# EAGLE design TestAnalog (EAGLE 5.11)
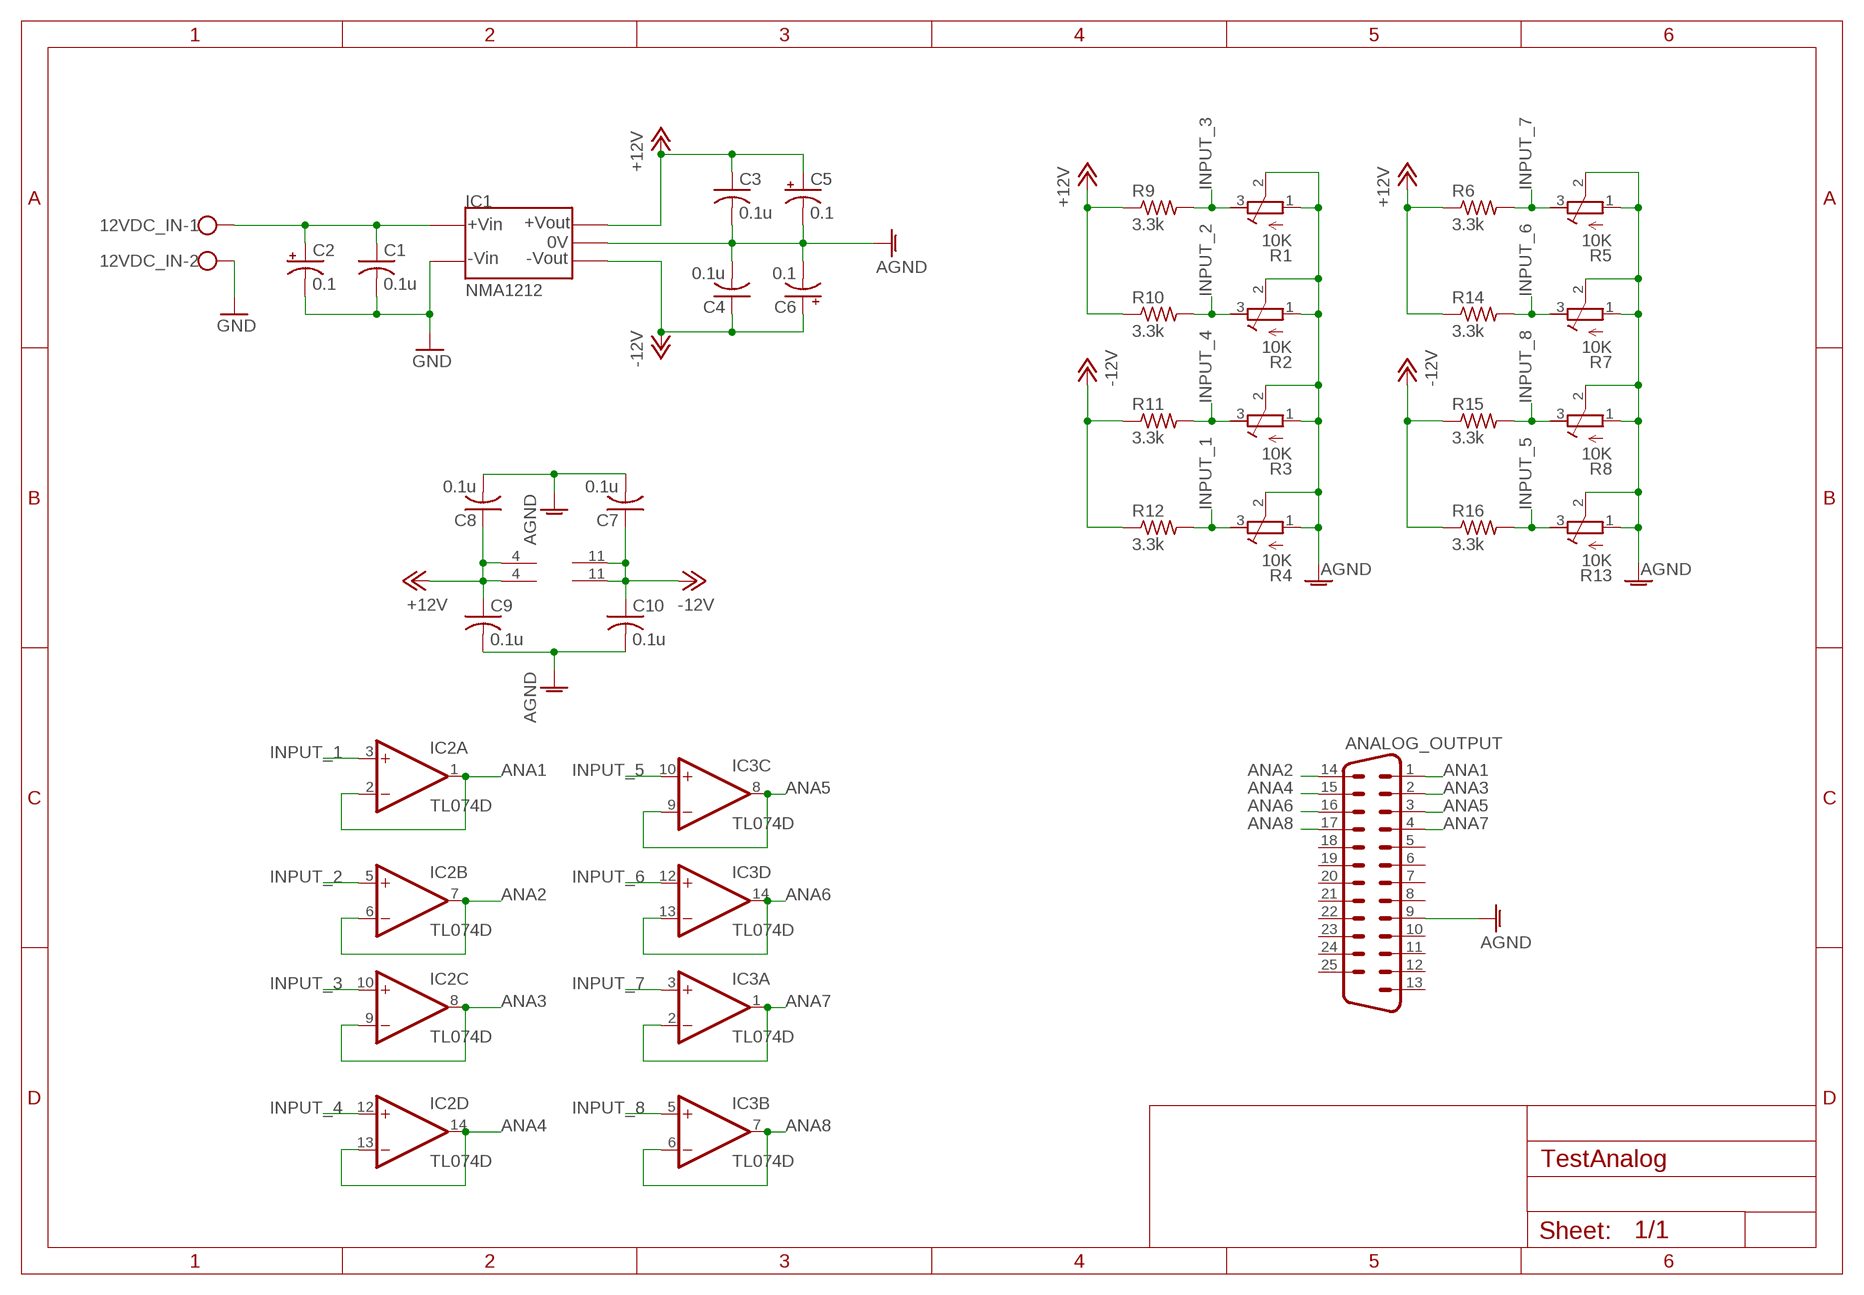
[diagram p0: schematic, sheet 1]

## Parts
12VDC_IN  W237-102  [W237-102]
ANALOG_OUTPUT  M25HP  [M25HP]
C1  0.1u  C-USC0603  [C0603]
C2  0.1  CPOL-USB45181A  [B45181A]
C3  0.1u  C-USC0603  [C0603]
C4  0.1u  C-USC0603  [C0603]
C5  0.1  CPOL-USB45181A  [B45181A]
C6  0.1  CPOL-USB45181A  [B45181A]
C7  0.1u  C-USC0603  [C0603]
C8  0.1u  C-USC0603  [C0603]
C9  0.1u  C-USC0603  [C0603]
C10  0.1u  C-USC0603  [C0603]
IC1  NMA1212  NMA1512DC  [NMA1512DC]
IC2  TL074D  [SO14]
IC3  TL074D  [SO14]
R1  10K  R-TRIMM64W  [RTRIM64W]
R2  10K  R-TRIMM64W  [RTRIM64W]
R3  10K  R-TRIMM64W  [RTRIM64W]
R4  10K  R-TRIMM64W  [RTRIM64W]
R5  10K  R-TRIMM64W  [RTRIM64W]
R6  3.3k  R-US_R0805  [R0805]
R7  10K  R-TRIMM64W  [RTRIM64W]
R8  10K  R-TRIMM64W  [RTRIM64W]
R9  3.3k  R-US_R0805  [R0805]
R10  3.3k  R-US_R0805  [R0805]
R11  3.3k  R-US_R0805  [R0805]
R12  3.3k  R-US_R0805  [R0805]
R13  10K  R-TRIMM64W  [RTRIM64W]
R14  3.3k  R-US_R0805  [R0805]
R15  3.3k  R-US_R0805  [R0805]
R16  3.3k  R-US_R0805  [R0805]

## Nets
+12V: C3.1 C5.+ C8.1 C9.1 IC1.+VOUT IC2.4(P:V+) IC3.4(P:V+) R6.1 R9.1 R10.1 R14.1
-12V: C4.1 C6.+ C7.1 C10.1 IC1.-VOUT IC2.11(P:V-) IC3.11(P:V-) R11.1 R12.1 R15.1 R16.1
AGND: ANALOG_OUTPUT.9 C3.2 C4.2 C5.- C6.- C7.2 C8.2 C9.2 C10.2 IC1.0V R1.1(E) R1.2(S) R2.1(E) R2.2(S) R3.1(E) R3.2(S) R4.1(E) R4.2(S) R5.1(E) R5.2(S) R7.1(E) R7.2(S) R8.1(E) R8.2(S) R13.1(E) R13.2(S)
ANA1: ANALOG_OUTPUT.1 IC2.1(A:OUT) IC2.2(A:-IN)
ANA2: ANALOG_OUTPUT.14 IC2.6(B:-IN) IC2.7(B:OUT)
ANA3: ANALOG_OUTPUT.2 IC2.8(C:OUT) IC2.9(C:-IN)
ANA4: ANALOG_OUTPUT.15 IC2.13(D:-IN) IC2.14(D:OUT)
ANA5: ANALOG_OUTPUT.3 IC3.8(C:OUT) IC3.9(C:-IN)
ANA6: ANALOG_OUTPUT.16 IC3.13(D:-IN) IC3.14(D:OUT)
ANA7: ANALOG_OUTPUT.4 IC3.1(A:OUT) IC3.2(A:-IN)
ANA8: ANALOG_OUTPUT.17 IC3.6(B:-IN) IC3.7(B:OUT)
GND: 12VDC_IN.2 C1.2 C2.- IC1.-VIN
INPUT_1: IC2.3(A:+IN) R4.3(A) R12.2
INPUT_2: IC2.5(B:+IN) R2.3(A) R10.2
INPUT_3: IC2.10(C:+IN) R1.3(A) R9.2
INPUT_4: IC2.12(D:+IN) R3.3(A) R11.2
INPUT_5: IC3.10(C:+IN) R13.3(A) R16.2
INPUT_6: IC3.12(D:+IN) R7.3(A) R14.2
INPUT_7: IC3.3(A:+IN) R5.3(A) R6.2
INPUT_8: IC3.5(B:+IN) R8.3(A) R15.2
N$1: 12VDC_IN.1 C1.1 C2.+ IC1.+VIN
Unconnected: ANALOG_OUTPUT.5 ANALOG_OUTPUT.6 ANALOG_OUTPUT.7 ANALOG_OUTPUT.8 ANALOG_OUTPUT.10 ANALOG_OUTPUT.11 ANALOG_OUTPUT.12 ANALOG_OUTPUT.13 ANALOG_OUTPUT.18 ANALOG_OUTPUT.19 ANALOG_OUTPUT.20 ANALOG_OUTPUT.21 ANALOG_OUTPUT.22 ANALOG_OUTPUT.23 ANALOG_OUTPUT.24 ANALOG_OUTPUT.25

## Library data of the parts
12VDC_IN = con-wago-500:W237-102: WAGO SCREW CLAMP; MPN: 237-102; OC_FARNELL: unknown; OC_NEWARK: 70K9898
ANALOG_OUTPUT = con-subd:M25: SUB-D; OC_FARNELL: unknown; OC_NEWARK: unknown
C1 C3 C4 C7-C10 = rcl:C-US: CAPACITOR, American symbol
C2 C5 C6 = rcl:CPOL-US: POLARIZED CAPACITOR, American symbol
IC1 = magnetometro:NMA1512DC
IC2 IC3 = linear:TL074: OP AMP
R1-R5 R7 R8 R13 = rcl:R-TRIMM: Trimm resistor
R6 R9-R12 R14-R16 = rcl:R-US_: RESISTOR, American symbol

## Board
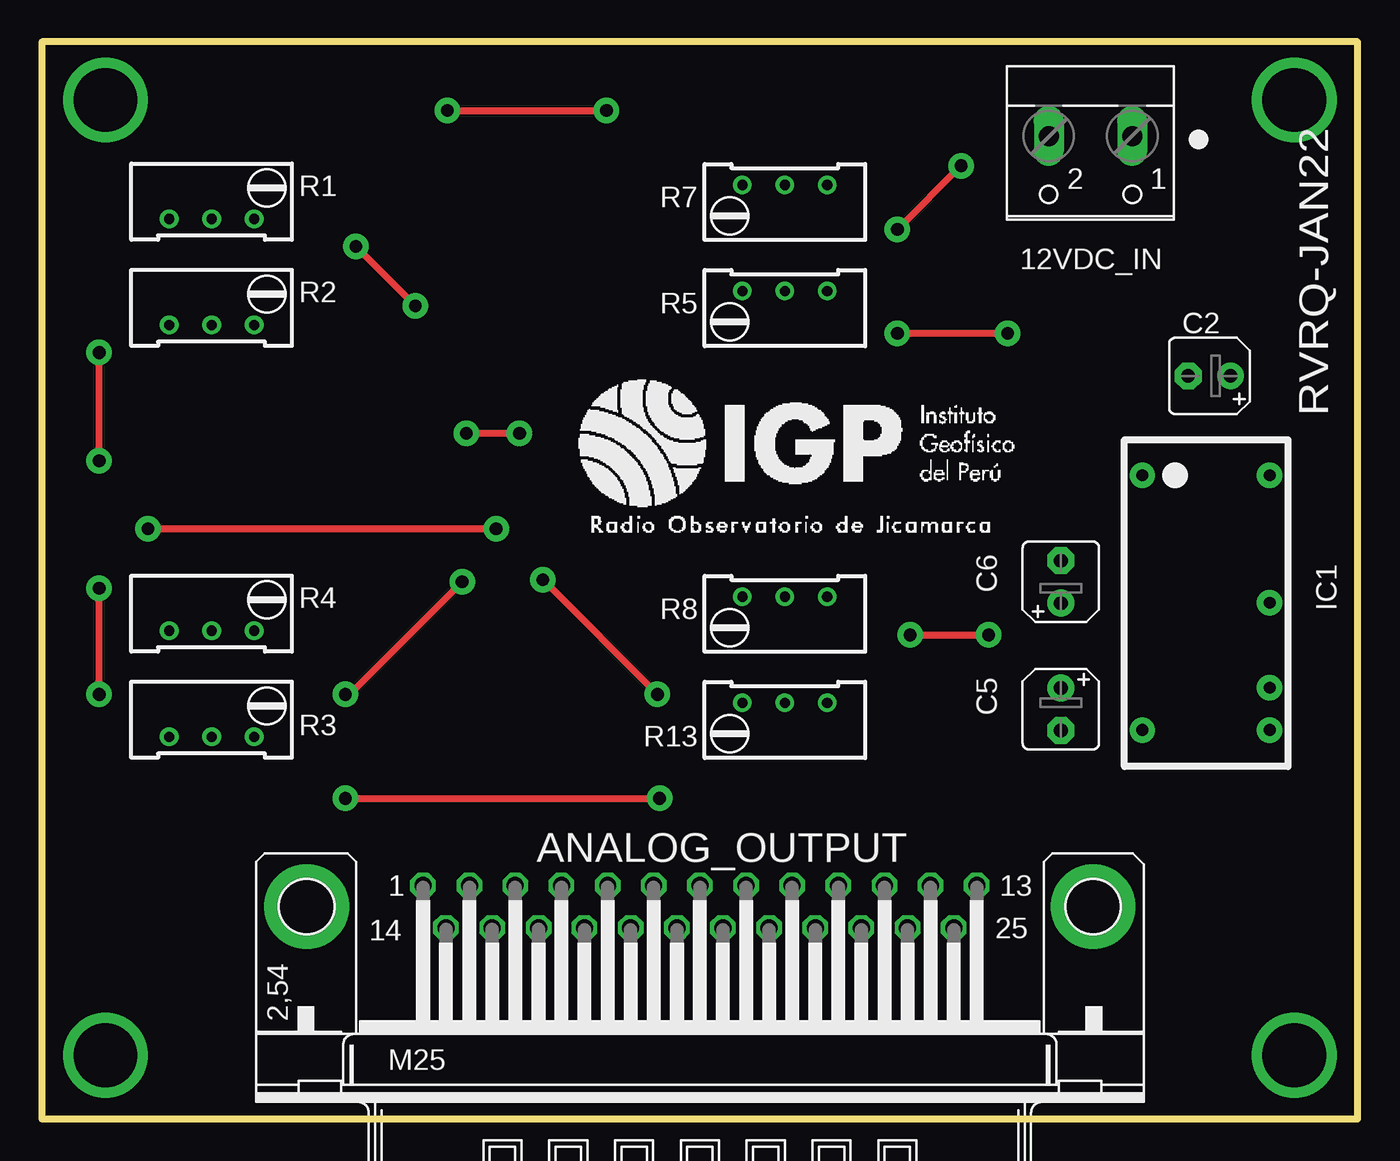
[diagram p1: board, top side]
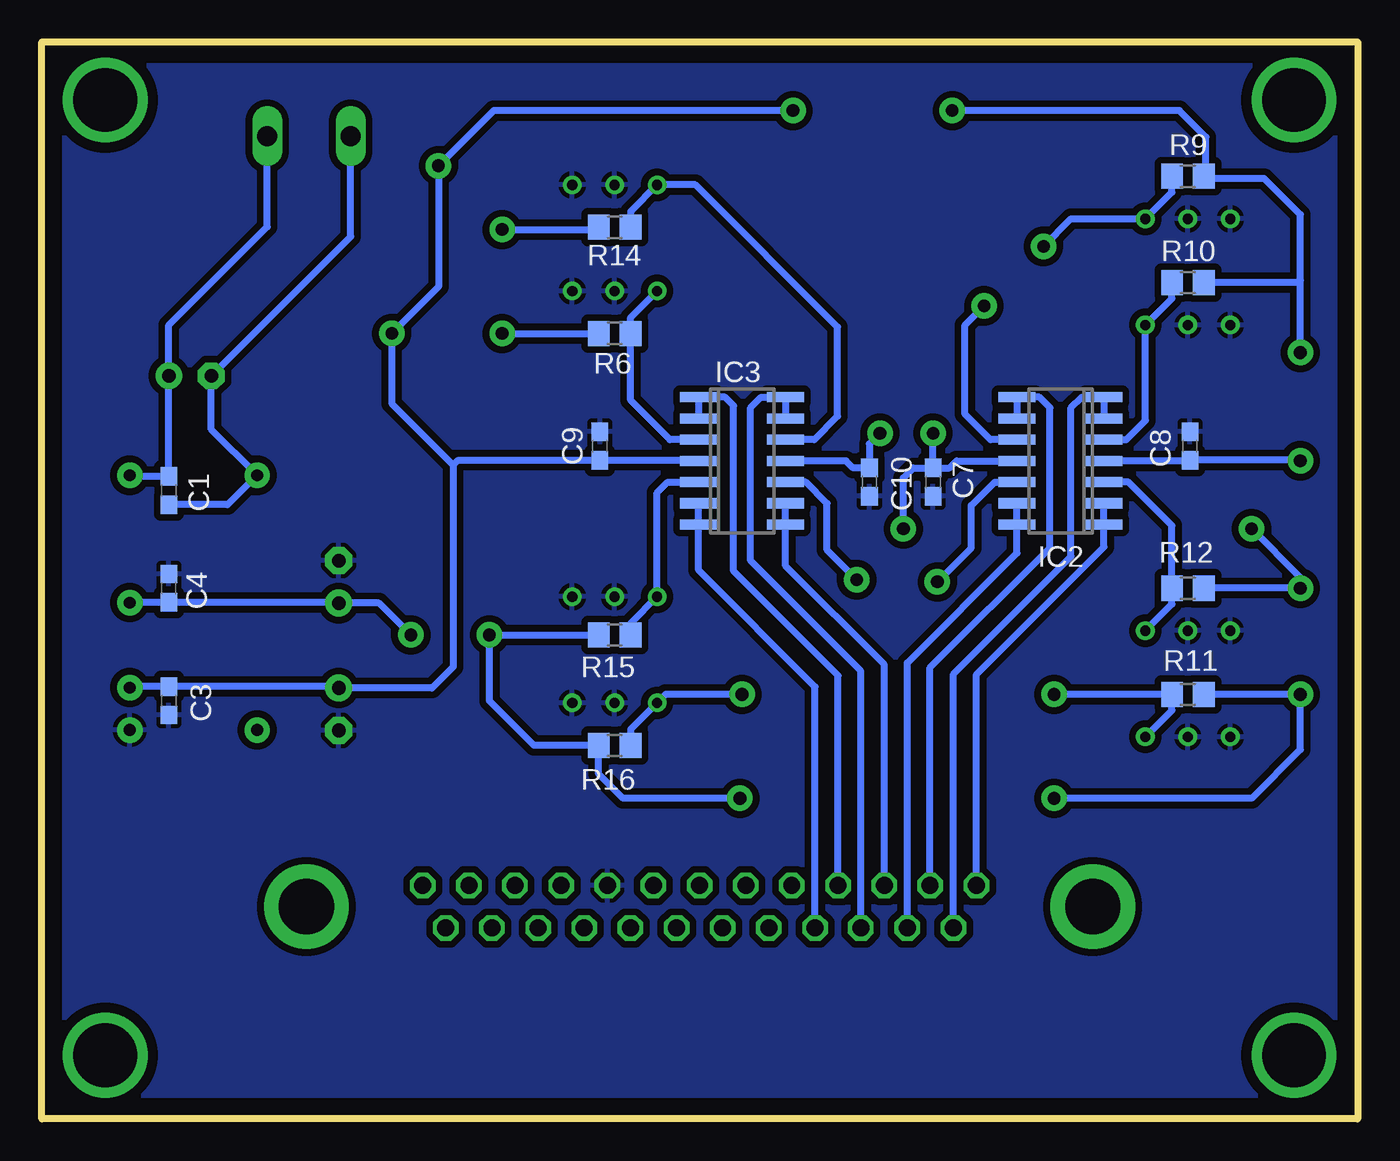
[diagram p2: board, bottom side, seen from below]

Size 78.72 x 64.44 mm. Coordinates in mm from the lower left corner, seen from the top.
Outline: 0,0 78.72,0 78.72,64.44 0,64.44 0,0
Copper layers (1*16): Top 0.035mm / dielectric 1.5mm / Bottom 0.035mm
Design rules "default": minimum track width 10mil, minimum drill 24mil, track to track 8mil, track to pad 8mil, pad to pad 8mil, via to via 8mil, smd to smd 8mil, copper to edge 40mil, drill to drill 8mil, minimum pad ring 10mil, minimum via ring 8mil, stop-mask expansion 4mil, vias tented up to drill 0mil, thermal gap 10mil
bRestrict: area 1.3,58.4 to 6.3,63.5; area 1.3,1.3 to 6.3,6.3; area 72.4,58.4 to 77.5,63.5; area 72.4,1.3 to 77.5,6.3

### Footprints (pad centres in the part's own frame; a part is rotated, then mirrored left to right if it is on the bottom)
W237-102 = drill 1.194 long: 1 -2.5,-0.381; 2 2.5,-0.381
M25HP = drill 1.016 octagon: 1 -16.561,1.27; 2 -13.792,1.27; 3 -11.049,1.27; 4 -8.28,1.27; 5 -5.512,1.27; 6 -2.769,1.27; 7 0,1.27; 8 2.769,1.27; 9 5.512,1.27; 10 8.28,1.27; 11 11.049,1.27; 12 13.792,1.27; 13 16.561,1.27; 14 -15.189,-1.27; 15 -12.421,-1.27; 16 -9.652,-1.27; 17 -6.909,-1.27; 18 -4.14,-1.27; 19 -1.372,-1.27; 20 1.372,-1.27; 21 4.14,-1.27; 22 6.909,-1.27; 23 9.652,-1.27; 24 12.421,-1.27; 25 15.189,-1.27 | drill 3.302 pad 5.08 round: G1 -23.52,0; G2 23.52,0
C0603 = smd 1.1 x 1: 1 -0.85,0; 2 0.85,0
B45181A = drill 0.813 pad 1.6 round: + -1.27,0 | drill 0.813 pad 1.6 octagon: - 1.27,0
NMA1512DC = drill 0.7 pad 1.524 round: 0V 17.374,8.687; +VIN 2.134,8.687; +VOUT 14.834,8.687; -VIN 2.134,1.067; -VOUT 9.754,8.687; NC 17.374,1.067
SO14 = smd 0.6 x 2.2: 1 -3.81,-2.6; 2 -2.54,-2.6; 3 -1.27,-2.6; 4 0,-2.6; 5 1.27,-2.6; 6 2.54,-2.6; 7 3.81,-2.6; 8 3.81,2.6; 9 2.54,2.6; 10 1.27,2.6; 11 0,2.6; 12 -1.27,2.6; 13 -2.54,2.6; 14 -3.81,2.6
RTRIM64W = drill 0.61 round: 1 1.27,-2.54; 2 1.27,0; 3 1.27,2.54
R0805 = smd 1.3 x 1.5: 1 -0.95,0; 2 0.95,0

### Placement (x,y rotation side)
12VDC_IN  62.74,58.42 180 top
ANALOG_OUTPUT  39.37,12.7 0 top
C1  71.12,37.59 270 bottom
C2  69.85,44.45 180 top
C3  71.12,25.02 270 bottom
C4  71.12,31.75 90 bottom
C5  60.96,24.51 270 top
C6  60.96,32.13 90 top
C7  25.4,38.1 270 bottom
C8  10.03,40.26 90 bottom
C9  45.34,40.26 90 bottom
C10  29.21,38.1 270 bottom
IC1  64.77,40.64 270 top
IC2  17.78,39.37 90 bottom
IC3  36.83,39.37 270 bottom
R1  10.16,55.12 270 top
R2  10.16,48.77 270 top
R3  10.16,24.13 270 top
R4  10.16,30.48 270 top
R5  44.45,48.26 90 top
R6  44.45,46.99 0 bottom
R7  44.45,54.61 90 top
R8  44.45,29.97 90 top
R9  10.16,56.39 180 bottom
R10  10.16,50.04 180 bottom
R11  10.16,25.4 180 bottom
R12  10.16,31.75 180 bottom
R13  44.45,23.62 90 top
R14  44.45,53.34 0 bottom
R15  44.45,28.96 0 bottom
R16  44.45,22.35 0 bottom

### Tracks (layer width: path | path; a pad name or v marks a point on that pad's centre or on a via)
+12V  (via drill 0.76 pad 1.52)
  Top 0.406: v3.43,39.37 v3.43,45.85 | v54.99,57.02 v51.18,53.21 | v57.78,46.99 v51.18,46.99 | v24.26,60.33 v33.78,60.33
  Bottom 0.406: IC2.4 10.07,39.37 C8.1 3.47,39.41 v3.43,39.37 | IC3.4 39.47,39.41 C9.1 | 9.08,56.26 9.08,58.74 10.67,60.33 v24.26,60.33 | IC1.+VOUT 73.39,25.87 C3.1 61.05,25.87 C5.+ 55.37,25.78 54.1,27.05 54.1,39.12 | 9.08,56.26 R9.1 | 9.08,56.26 5.59,56.26 3.43,54.1 3.43,50.16 | v3.43,45.85 3.43,50.16 | R10.1 3.56,50.04 3.43,50.16 | C9.1 45.38,39.37 | R14.1 45.53,53.21 v51.18,53.21 | v51.18,46.99 R6.1 | 54.1,39.12 57.78,42.8 v57.78,46.99 54.99,49.78 v54.99,57.02 51.69,60.33 v33.78,60.33 | C9.1 53.81,39.41 54.1,39.12
-12V  (via drill 0.76 pad 1.52)
  Top 0.406: v25.4,41.02 v28.57,41.02 | v51.94,28.96 v56.64,28.96 | v3.43,25.4 v3.43,31.75 | v18.16,19.18 v36.96,19.18 | v6.35,35.31 v27.18,35.31
  Bottom 0.406: IC2.11 24,39.37 24.42,38.95 C7.1 | IC3.11 30.61,39.37 30.19,38.95 C10.1 29.21,40.39 v28.57,41.02 | IC1.-VOUT C4.1 61,30.9 C6.+ 58.55,30.86 v56.64,28.96 | C7.1 v25.4,41.02 | R15.1 v51.94,28.96 51.94,25.02 49.28,22.35 R16.1 45.4,20.64 43.94,19.18 v36.96,19.18 | v18.16,19.18 6.35,19.18 3.43,22.1 v3.43,25.4 R11.1 | v6.35,35.31 3.43,32.38 v3.43,31.75 R12.1 | v27.18,35.31 27.18,38.35 26.58,38.95 C7.1
AGND
  pour Bottom (isolate 0.406): 0,63.12 78.74,63.12 78.74,0 0,0
ANA1
  Bottom 0.406: IC2.2 IC2.1 15.18,34.22 22.81,26.59 ANALOG_OUTPUT.1
ANA2
  Bottom 0.406: ANALOG_OUTPUT.14 24.18,26.62 17.14,33.66 17.14,42.55 16.51,43.18 IC2.7 IC2.6
ANA3
  Bottom 0.406: ANALOG_OUTPUT.2 25.58,27 18.41,34.16 18.41,42.55 19.05,43.18 IC2.8 IC2.9
ANA4
  Bottom 0.406: IC2.13 IC2.14 20.38,33.85 26.95,27.28 ANALOG_OUTPUT.15
ANA5
  Bottom 0.406: IC3.9 IC3.8 34.23,33.09 28.32,27.18 ANALOG_OUTPUT.3
ANA6
  Bottom 0.406: ANALOG_OUTPUT.16 29.72,26.8 36.32,33.4 36.32,42.55 35.69,43.18 IC3.14 IC3.13
ANA7
  Bottom 0.406: ANALOG_OUTPUT.4 31.09,26.52 37.34,32.77 37.34,42.67 37.85,43.18 IC3.1 IC3.2
ANA8
  Bottom 0.406: IC3.6 IC3.7 39.43,32.83 32.46,25.86 ANALOG_OUTPUT.17
GND
  Bottom 0.406: C1.2 67.6,36.74 IC1.-VIN 68.58,41.25 C2.- 60.24,52.79 12VDC_IN.2
INPUT_1
  Bottom 0.406: R4.3 11.11,30.8 R12.2 11.11,35.49 13.72,38.1 IC2.3
INPUT_2
  Bottom 0.406: R10.2 11.11,49.09 R2.3 12.7,41.78 13.84,40.64 IC2.5
INPUT_3  (via drill 0.76 pad 1.52)
  Top 0.406: v22.35,48.64 v18.8,52.2
  Bottom 0.406: R9.2 11.11,55.44 R1.3 17.14,53.85 v18.8,52.2 | IC2.10 21.97,40.64 23.5,42.16 23.5,47.5 v22.35,48.64
INPUT_4  (via drill 0.76 pad 1.52)
  Top 0.406: v18.16,25.4 18.41,25.4 v25.15,32.13
  Bottom 0.406: R3.3 11.11,24.45 R11.2 v18.16,25.4 | v25.15,32.13 23.11,34.16 23.11,36.7 21.72,38.1 IC2.12
INPUT_5  (via drill 0.76 pad 1.52)
  Top 0.406: v29.97,32.26 v36.83,25.4
  Bottom 0.406: R16.2 43.5,23.3 R13.3 41.4,25.4 v36.83,25.4 | v29.97,32.26 31.75,34.04 31.75,36.83 33.02,38.1 IC3.10
INPUT_6
  Bottom 0.406: IC3.12 32.51,40.64 31.11,42.04 31.11,47.37 39.62,55.88 R7.3 43.5,54.29 R14.2
INPUT_7
  Bottom 0.406: R5.3 43.5,47.94 R6.2 43.5,42.99 41.15,40.64 IC3.3
INPUT_8
  Bottom 0.406: R15.2 43.5,29.65 R8.3 41.91,37.47 41.27,38.1 IC3.5
N$1
  Bottom 0.406: IC1.+VIN 73.46,38.44 C1.1 71.12,44.41 71.08,44.45 C2.+ 71.12,47.5 65.24,53.38 12VDC_IN.1
N$2  (via drill 3.81 pad 5.08)
  other vias: 3.81,60.96
N$3  (via drill 3.81 pad 5.08)
  other vias: 74.93,60.96
N$4  (via drill 3.81 pad 5.08)
  other vias: 74.93,3.81
N$5  (via drill 3.81 pad 5.08)
  other vias: 3.81,3.81

### Text on the board
tPlace: RVRQ-JAN22